# EAGLE design BreakoutV3 (EAGLE 7.6.0)
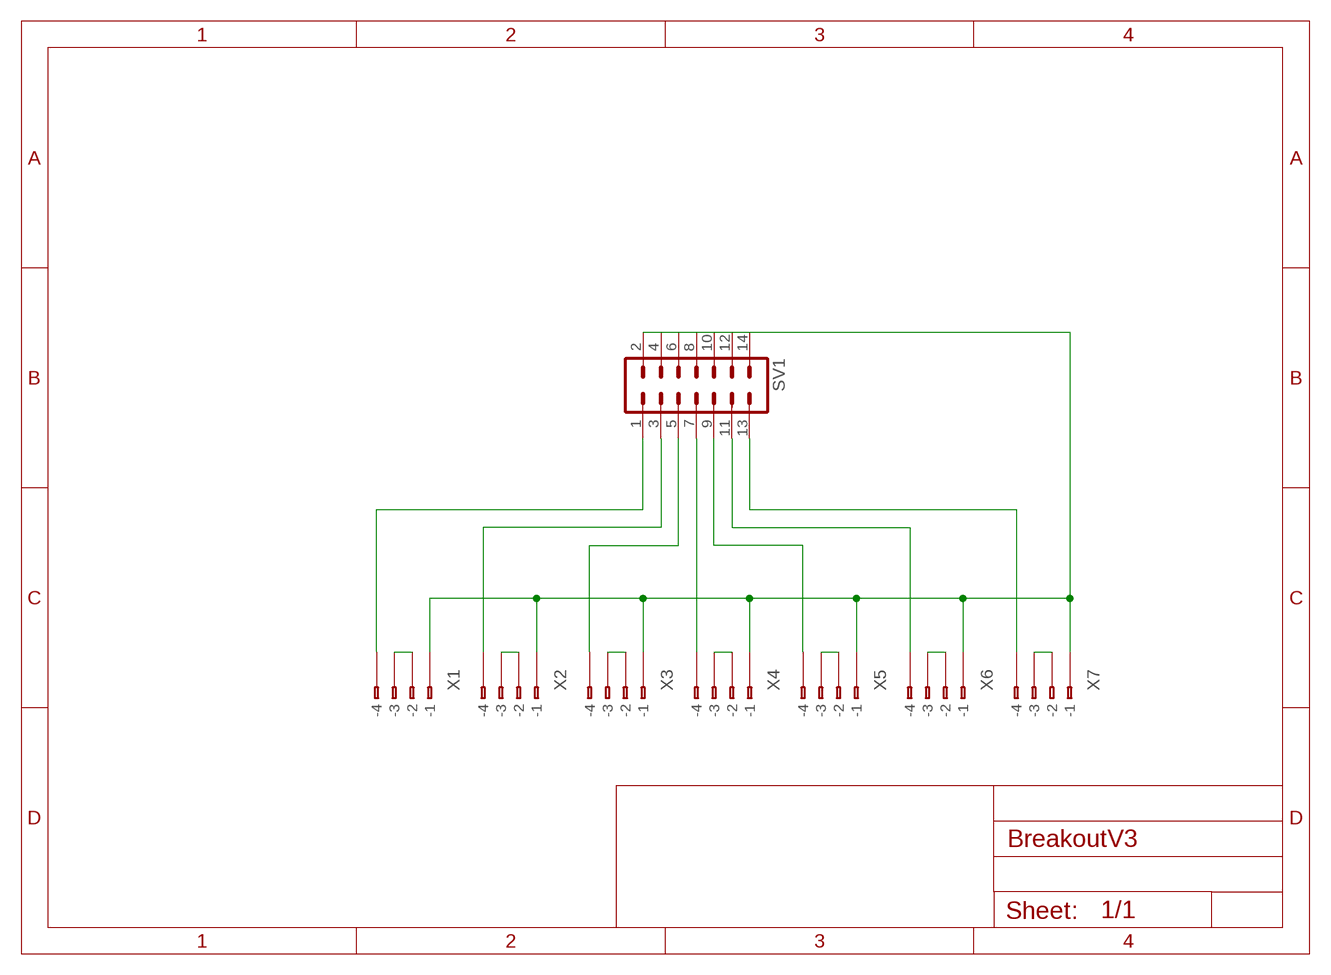
[diagram p0: schematic, sheet 1]

## Parts
SV1  ML14  [ML14]
X1  233-104  [233-104]
X2  233-104  [233-104]
X3  233-104  [233-104]
X4  233-104  [233-104]
X5  233-104  [233-104]
X6  233-104  [233-104]
X7  233-104  [233-104]

## Nets
N$1: X1.B2(B-2) X1.B3(B-3)
N$2: X2.B2(B-2) X2.B3(B-3)
N$3: X3.B2(B-2) X3.B3(B-3)
N$4: X4.B2(B-2) X4.B3(B-3)
N$5: X5.B2(B-2) X5.B3(B-3)
N$6: X6.B2(B-2) X6.B3(B-3)
N$7: X7.B2(B-2) X7.B3(B-3)
N$9: SV1.2 SV1.4 SV1.6 SV1.8 SV1.10 SV1.12 SV1.14 X1.B1(B-1) X2.B1(B-1) X3.B1(B-1) X4.B1(B-1) X5.B1(B-1) X6.B1(B-1) X7.B1(B-1)
N$10: SV1.1 X1.B4(B-4)
N$11: SV1.13 X7.B4(B-4)
N$12: SV1.3 X2.B4(B-4)
N$13: SV1.5 X3.B4(B-4)
N$14: SV1.7 X4.B4(B-4)
N$15: SV1.9 X5.B4(B-4)
N$16: SV1.11 X6.B4(B-4)
Unconnected: X1.A1(-1) X1.A2(-2) X1.A3(-3) X1.A4(-4) X2.A1(-1) X2.A2(-2) X2.A3(-3) X2.A4(-4) X3.A1(-1) X3.A2(-2) X3.A3(-3) X3.A4(-4) X4.A1(-1) X4.A2(-2) X4.A3(-3) X4.A4(-4) X5.A1(-1) X5.A2(-2) X5.A3(-3) X5.A4(-4) X6.A1(-1) X6.A2(-2) X6.A3(-3) X6.A4(-4) X7.A1(-1) X7.A2(-2) X7.A3(-3) X7.A4(-4)

## Library data of the parts
SV1 = con-harting-ml:ML14: HARTING; OC_FARNELL: unknown; OC_NEWARK: unknown
X1-X7 = con-wago:233-104: WAGO Cage Clamp; MPN: 233-104; OC_FARNELL: unknown; OC_NEWARK: 28K9046

## Board
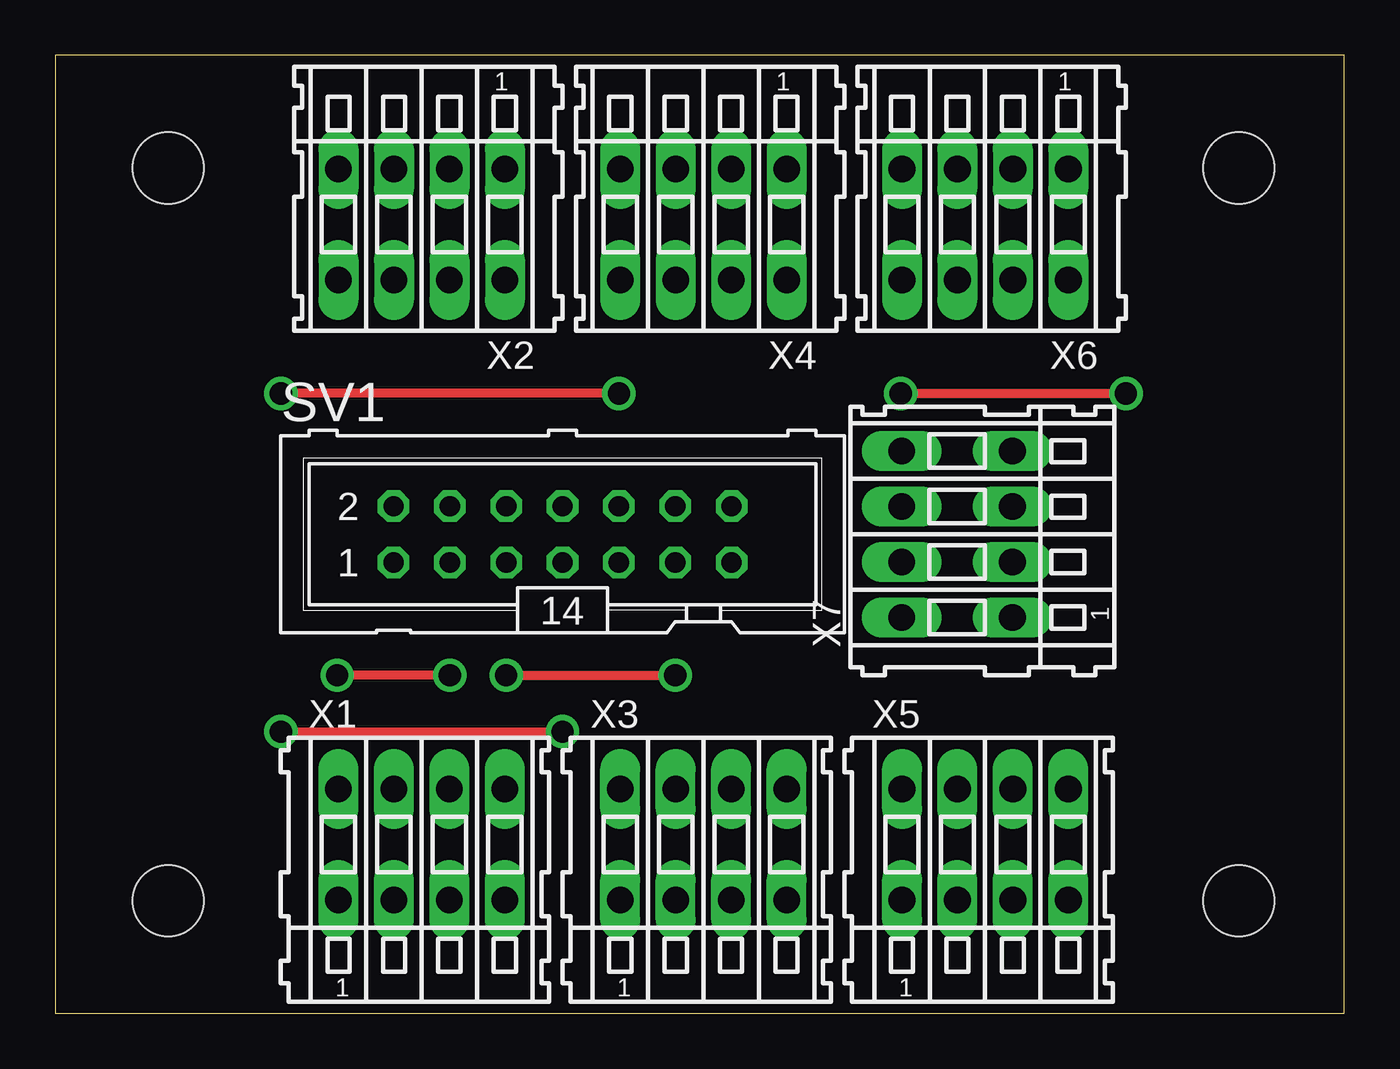
[diagram p1: board, top side]
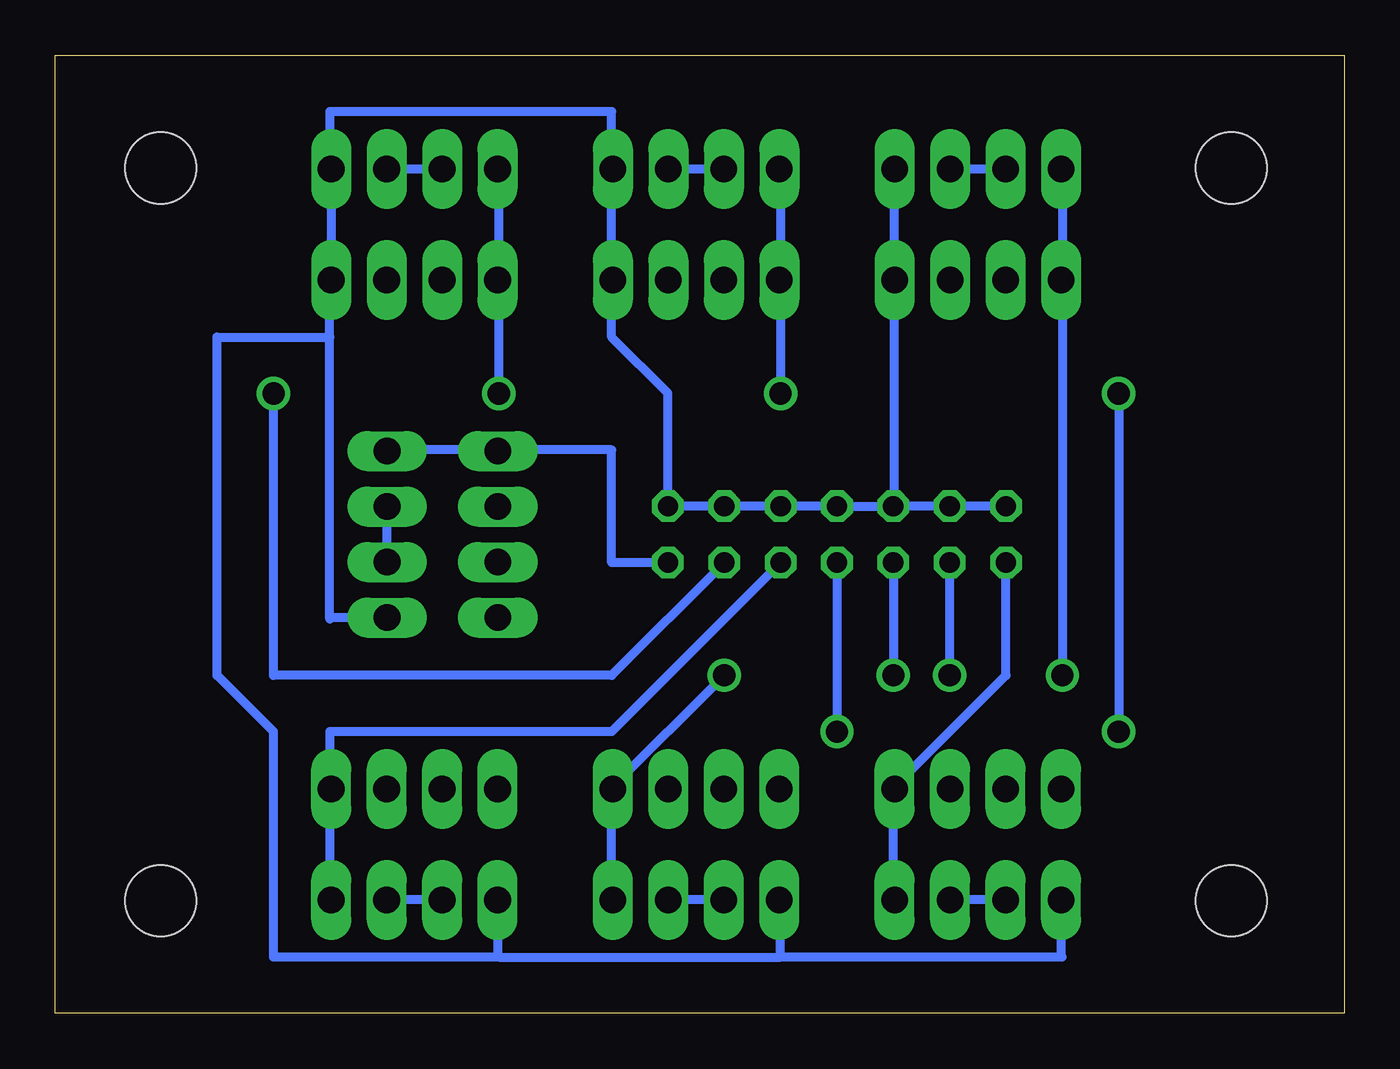
[diagram p2: board, bottom side, seen from below]

Size 58.09 x 43.17 mm. Coordinates in mm from the lower left corner, seen from the top.
Outline: 0,0 58.09,0 58.09,43.17 0,43.17 0,0
Copper layers (1*16): Top 0.035mm / dielectric 1.5mm / Bottom 0.035mm
Design rules "default": minimum track width 10mil, minimum drill 24mil, track to track 8mil, track to pad 8mil, pad to pad 8mil, via to via 8mil, smd to smd 8mil, copper to edge 40mil, drill to drill 8mil, minimum pad ring 10mil, minimum via ring 8mil, stop-mask expansion 4mil, vias tented up to drill 0mil, thermal gap 10mil
Holes 3.2 mm at 5.08,38.1 53.34,38.1 53.34,5.08 5.08,5.08

### Footprints (pad centres in the part's own frame; a part is rotated, then mirrored left to right if it is on the bottom)
ML14 = drill 0.914 octagon: 1 -7.62,-1.27; 2 -7.62,1.27; 3 -5.08,-1.27; 4 -5.08,1.27; 5 -2.54,-1.27; 6 -2.54,1.27; 7 0,-1.27; 8 0,1.27; 9 2.54,-1.27; 10 2.54,1.27; 11 5.08,-1.27; 12 5.08,1.27; 13 7.62,-1.27; 14 7.62,1.27
233-104 = drill 1.2 long: A1 -3.75,2.5; A2 -1.25,2.5; A3 1.25,2.5; A4 3.75,2.5; B1 -3.75,-2.5; B2 -1.25,-2.5; B3 1.25,-2.5; B4 3.75,-2.5

### Placement (x,y rotation side)
SV1  22.86,21.59 0 top
X1  16.51,7.62 0 top
X2  16.51,35.56 180 top
X3  29.21,7.62 0 top
X4  29.21,35.56 180 top
X5  41.91,7.62 0 top
X6  41.91,35.56 180 top
X7  40.64,21.59 90 top

### Tracks (layer width: path | path; a pad name or v marks a point on that pad's centre or on a via)
N$1
  Bottom 0.406: X1.B2 X1.B3
N$2
  Bottom 0.406: X2.B2 X2.B3
N$3
  Bottom 0.406: X3.B2 X3.B3
N$4
  Bottom 0.406: X4.B2 X4.B3
N$5
  Bottom 0.406: X5.B2 X5.B3
N$6
  Bottom 0.406: X6.B2 X6.B3
N$7
  Bottom 0.406: X7.B2 X7.B3
N$9
  Bottom 0.406: SV1.6 SV1.4 SV1.2 | SV1.6 SV1.8 SV1.10 SV1.12 SV1.14 30.48,27.94 33.02,30.48 33.02,38 | SV1.6 20.26,22.92 X2.B1 | 33.02,38 X4.B1 | X1.B1 12.76,2.6 12.7,2.54 25.4,2.54 | 25.4,2.54 25.4,5.06 X3.B1 | 38.1,2.54 25.4,2.54 | X7.B1 45.66,17.84 45.72,17.78 45.72,30.48 | 45.72,30.48 45.72,33.02 45.66,33.08 X6.B1 45.72,38.12 45.72,40.64 33.02,40.64 33.02,38 | X5.B1 38.16,2.6 38.1,2.54 | 38.1,2.54 48.26,2.54 48.26,12.7 50.8,15.24 50.8,30.48 45.72,30.48
N$10
  Bottom 0.406: X1.B4 20.32,5.18 20.32,10.16 15.24,15.24 SV1.1
N$11
  Bottom 0.406: SV1.13 33.02,20.32 33.02,25.4 43.14,25.4 X7.B4
N$12  (via drill 1)
  Top 0.406: v17.78,15.24 v12.7,15.24
  Bottom 0.406: X2.B4 12.7,38.06 v12.7,15.24 | SV1.3 v17.78,15.24
N$13  (via drill 1)
  Top 0.406: v20.32,15.24 v27.94,15.24
  Bottom 0.406: SV1.5 v20.32,15.24 | X3.B4 33.02,5.12 33.02,10.16 v27.94,15.24
N$14  (via drill 1)
  Top 0.406: v25.4,27.94 v10.16,27.94 | v10.16,12.7 v22.86,12.7
  Bottom 0.406: X4.B4 25.4,38.06 v25.4,27.94 | v10.16,27.94 v10.16,12.7 | SV1.7 v22.86,12.7
N$15
  Bottom 0.406: SV1.9 33.02,12.7 45.72,12.7 45.72,5.18 X5.B4
N$16  (via drill 1)
  Top 0.406: v38.1,27.94 v48.26,27.94
  Bottom 0.406: SV1.11 33.02,15.24 48.26,15.24 v48.26,27.94 | v38.1,27.94 38.1,38 X6.B4